# Altium schematic sheet CM4_HighSpeed.SchDoc: CM4_HighSpeed
size A4; SheetNumber: 2; SheetTotal: 2
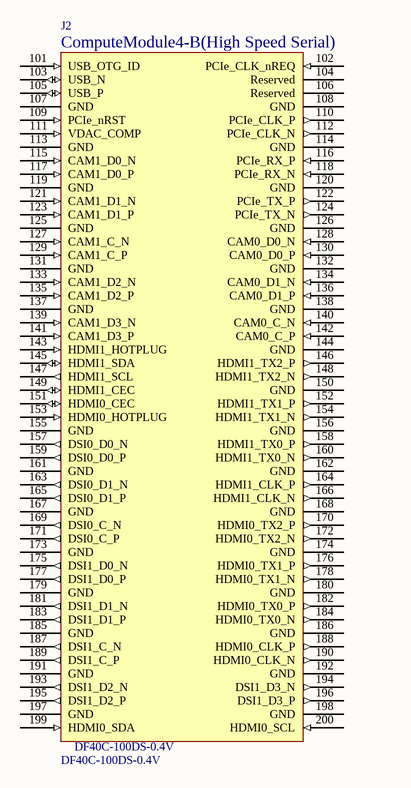
[diagram p0: CM4_HighSpeed.SchDoc]

## Parts
J2  DF40C-100DS-0.4V  [DF40C100DS04V51(CM4-B)]

## Nets

Not connected (* = marked no-connect by the designer): J2 101(USB_OTG_ID) 102(PCIe_CLK_nREQ) 103(USB_N) 104(Reserved) 105(USB_P) 106(Reserved) 107(GND) 108(GND) 109(PCIe_nRST) 110(PCIe_CLK_P) 111(VDAC_COMP) 112(PCIe_CLK_N) 113(GND) 114(GND) 115(CAM1_D0_N) 116(PCIe_RX_P) 117(CAM1_D0_P) 118(PCIe_RX_N) 119(GND) 120(GND) 121(CAM1_D1_N) 122(PCIe_TX_P) 123(CAM1_D1_P) 124(PCIe_TX_N) 125(GND) 126(GND) 127(CAM1_C_N) 128(CAM0_D0_N) 129(CAM1_C_P) 130(CAM0_D0_P) 131(GND) 132(GND) 133(CAM1_D2_N) 134(CAM0_D1_N) 135(CAM1_D2_P) 136(CAM0_D1_P) 137(GND) 138(GND) 139(CAM1_D3_N) 140(CAM0_C_N) 141(CAM1_D3_P) 142(CAM0_C_P) 143(HDMI1_HOTPLUG) 144(GND) 145(HDMI1_SDA) 146(HDMI1_TX2_P) 147(HDMI1_SCL) 148(HDMI1_TX2_N) 149(HDMI1_CEC) 150(GND) 151(HDMI0_CEC) 152(HDMI1_TX1_P) 153(HDMI0_HOTPLUG) 154(HDMI1_TX1_N) 155(GND) 156(GND) 157(DSI0_D0_N) 158(HDMI1_TX0_P) 159(DSI0_D0_P) 160(HDMI1_TX0_N) 161(GND) 162(GND) 163(DSI0_D1_N) 164(HDMI1_CLK_P) 165(DSI0_D1_P) 166(HDMI1_CLK_N) 167(GND) 168(GND) 169(DSI0_C_N) 170(HDMI0_TX2_P) 171(DSI0_C_P) 172(HDMI0_TX2_N) 173(GND) 174(GND) 175(DSI1_D0_N) 176(HDMI0_TX1_P) 177(DSI1_D0_P) 178(HDMI0_TX1_N) 179(GND) 180(GND) 181(DSI1_D1_N) 182(HDMI0_TX0_P) 183(DSI1_D1_P) 184(HDMI0_TX0_N) 185(GND) 186(GND) 187(DSI1_C_N) 188(HDMI0_CLK_P) 189(DSI1_C_P) 190(HDMI0_CLK_N) 191(GND) 192(GND) 193(DSI1_D2_N) 194(DSI1_D3_N) 195(DSI1_D2_P) 196(DSI1_D3_P) 197(GND) 198(GND) 199(HDMI0_SDA) 200(HDMI0_SCL)

## Notes on the sheet
- Sheet Title:
- Project Title:
- Date:
- Revision:
- Time:
- Variant:
- Size:
- Sheet
- A4
- of
- www.soundwedge.com.hk <http://www.soundwedge.com.hk>
- File:
- Author:
- (in symbol RPi-CM4-B) ComputeModule4-B(High Speed Serial)

## Library data of the parts
J2 = RPi-CM4-B: CM4-B High Speed Serial